# EAGLE schematic M.2 SoM breakout board v0.2-Placement-0305 (EAGLE 9.6.2)
Assembly variants: EVT, proto-click

## Sheet 1 of 3
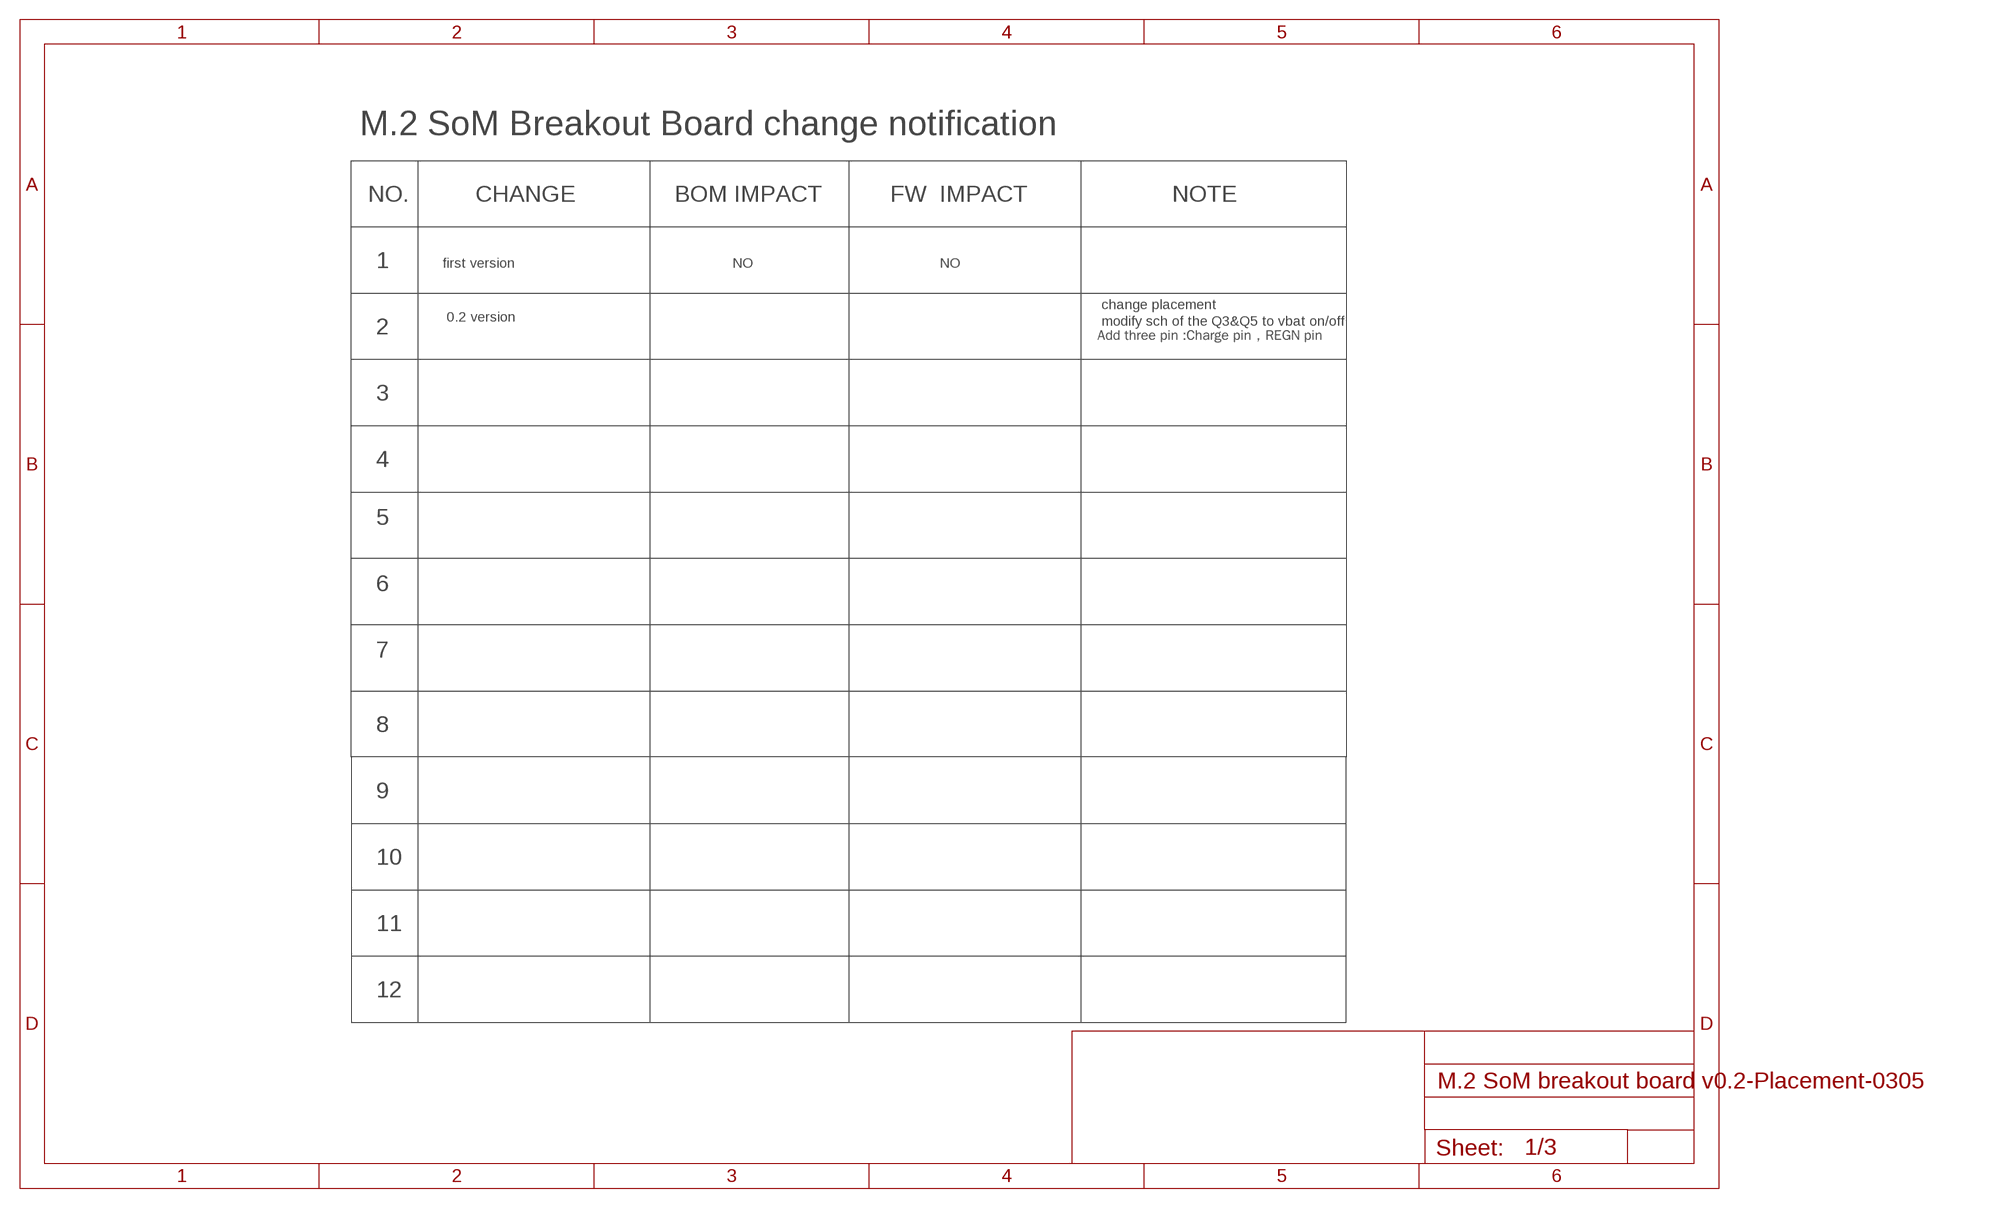
[diagram p0: schematic, sheet 1]

### Notes on the sheet
- M.2 SoM Breakout Board change notification
- NO. | CHANGE | BOM IMPACT | FW  IMPACT | NOTE
- 1 | first version | NO | NO
- change placement
- 0.2 version
- modify sch of the Q3&Q5 to vbat on/off
- 2
- Add three pin :Charge pin，REGN pin
- 3
- 4
- 5
- 6
- 7
- 8
- 9
- 10
- 11
- 12

## Sheet 2 of 3: BSOM
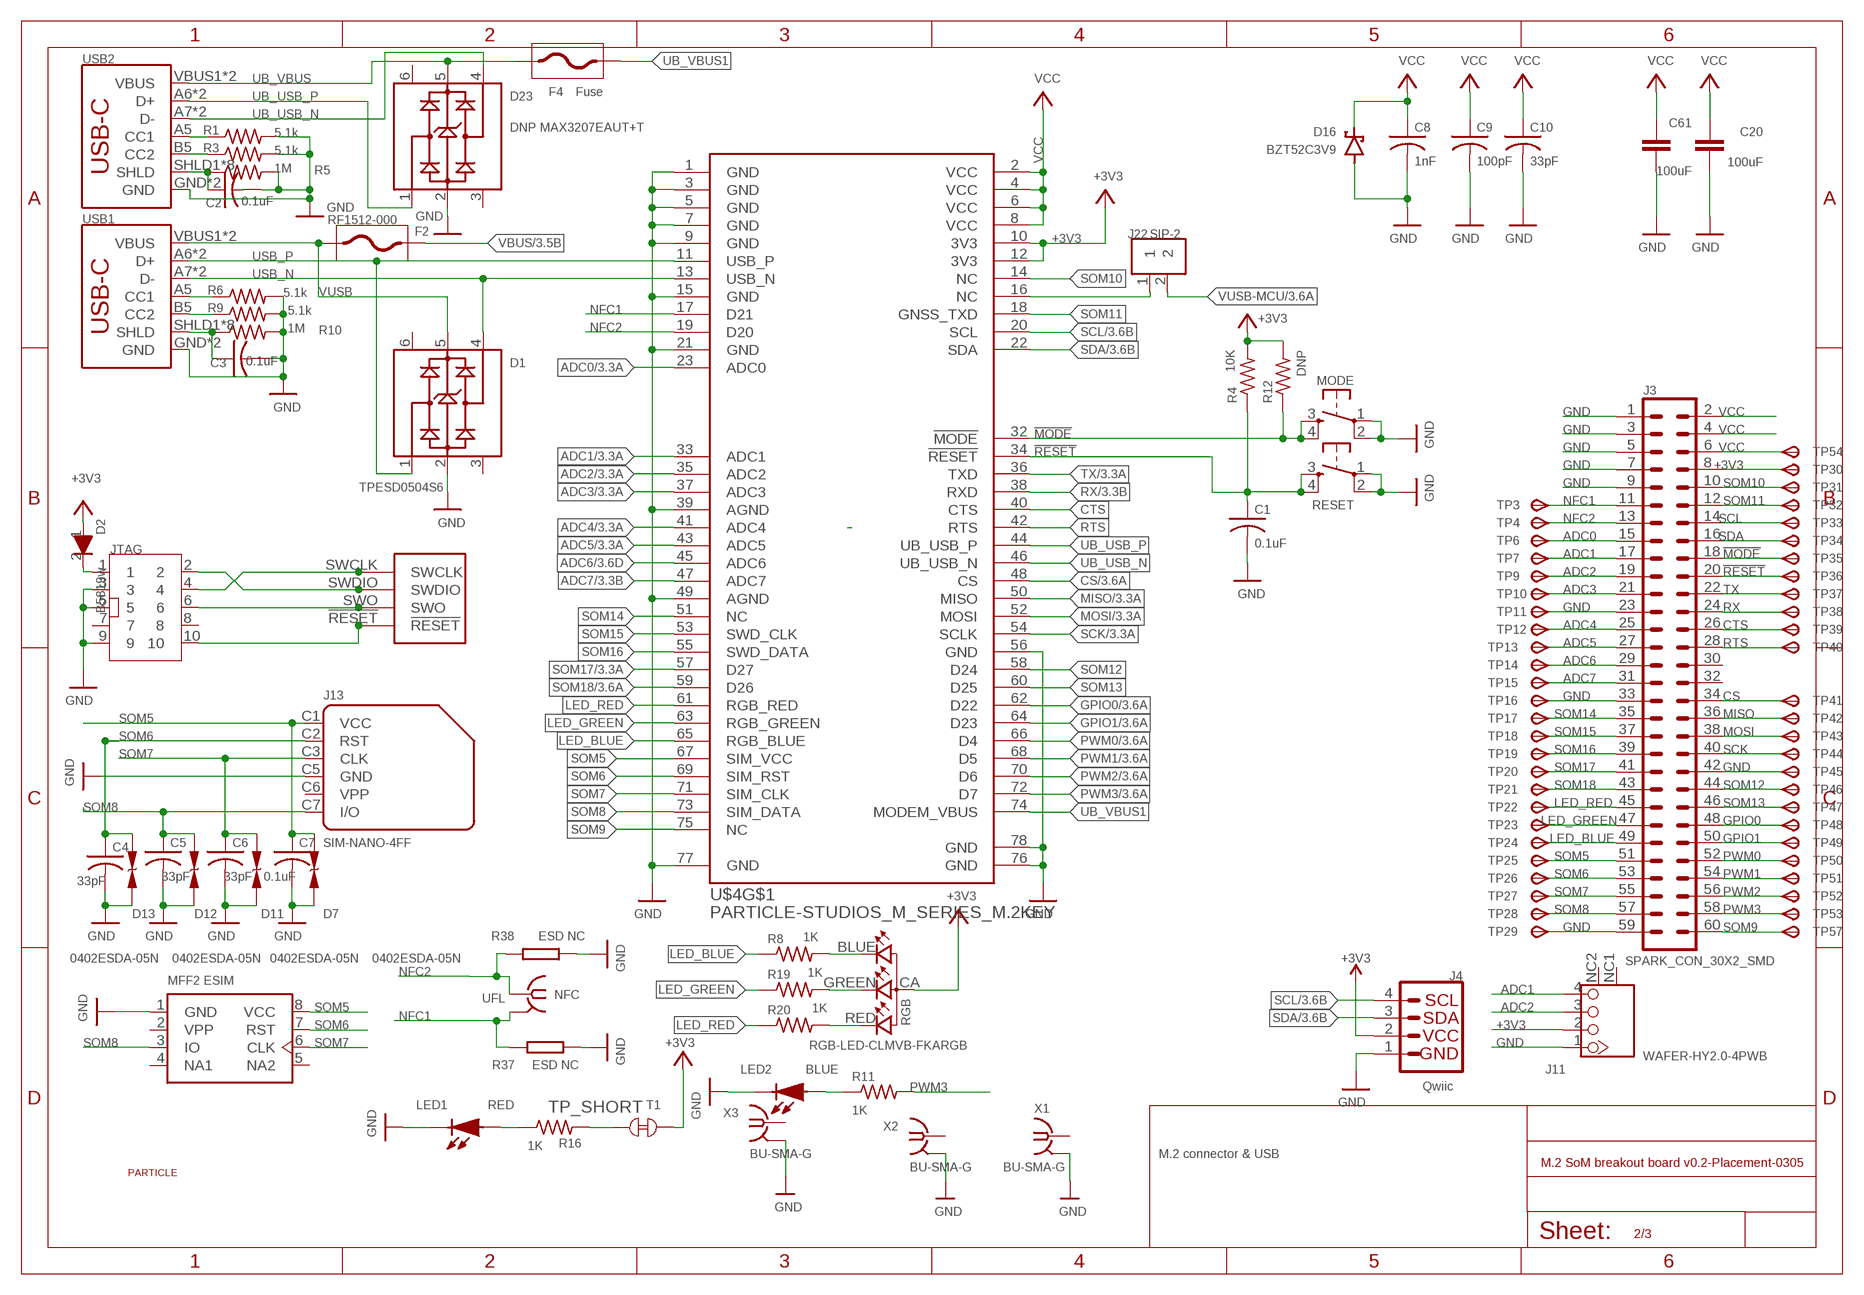
[diagram p1: schematic, sheet 2]

### Parts
C1  0.1uF  C-US  [C0402_B]
C2  0.1uF  C-US  [C0402_B]
C3  0.1uF  C-US  [C0402_B]
C4  33pF  C-US  [C0402_B]
C5  33pF  C-US  [C0402_B]
C6  33pF  C-US  [C0402_B]
C7  0.1uF  C-US  [C0402_B]
C8  1nF  C-US  [C0402_B]
C9  100pF  C-US  [C0402_B]
C10  33pF  C-US  [C0402_B]
C20  100uF  C-EUC1206K  [C1206K]
C61  100uF  C-EUC1206K  [C1206K]
D1  TPESD0504S6  MAX3207EAUT+T  [SOT23-6]
D2  B5819w  DIODESOD123  [SOD-123]
D7  0402ESDA-05N  ESD  [C0402]
D11  0402ESDA-05N  ESD  [C0402]
D12  0402ESDA-05N  ESD  [C0402]
D13  0402ESDA-05N  ESD  [C0402]
D16  BZT52C3V9  MBR0520LT1G  [SOD-123]
D23  DNP MAX3207EAUT+T  MAX3207EAUT+T  [SOT23-6]  (not fitted in variant EVT)
F2  RF1512-000  FUSEF1206  [R1206]
F4  Fuse  FUSE  [F0805]
J3  SPARK_CON_30X2_SMD  [SPARK_CON_30X2_SMD]
J4  QWIIC_CONNECTORJS-1MM  [1X04_1MM_RA]
J11  WAFER-HY2.0-4PWB  [WAFER-HY2.0-4PWB]
J13  SIM-NANO-4FF  [GCT-SIM8100]
J22  SIP-2  [SIP-2]
JTAG  CONN5X2  [CONN5X2_1.27]  (not fitted in variant EVT)
LED1  RED  LED  [LED0603]
LED2  BLUE  LED  [LED0603]
MODE  TAC_SWITCHSMD  [TACTILE_SWITCH_SMD]
NFC  UFL  IPEX-20279-001E  [IPEX-20279-001E]
R1  5.1k  R-US_  [R0402_B]
R3  5.1k  R-US_  [R0402_B]
R4  10K  R-US_  [R0402_B]
R5  1M  R-US_  [R0402_B]
R6  5.1k  R-US_  [R0402_B]
R8  1K  R-US_  [R0402_B]
R9  5.1k  R-US_  [R0402_B]
R10  1M  R-US_  [R0402_B]
R11  1K  R-US_  [R0402_B]
R12  DNP  R-US_  [R0402_B]
R16  1K  R-US_  [R0402_B]
R19  1K  R-US_  [R0402_B]
R20  1K  R-US_  [R0402_B]
R37  ESD NC  RES0402S  [R-0402S]
R38  ESD NC  RES0402S  [R-0402S]
RESET  TAC_SWITCHSMD  [TACTILE_SWITCH_SMD]
RGB  RGB-LED-CLMVB-FKARGB  [PLCC4-2MM-RGB]
T1  TP_SHORT  [TP_SHORT]
TP3  TPSB1,27  [B1,27]
TP4  TPSB1,27  [B1,27]
TP6  TPSB1,27  [B1,27]
TP7  TPSB1,27  [B1,27]
TP9  TPSB1,27  [B1,27]
TP10  TPSB1,27  [B1,27]
TP11  TPSB1,27  [B1,27]
TP12  TPSB1,27  [B1,27]
TP13  TPSB1,27  [B1,27]
TP14  TPSB1,27  [B1,27]
TP15  TPSB1,27  [B1,27]
TP16  TPSB1,27  [B1,27]
TP17  TPSB1,27  [B1,27]
TP18  TPSB1,27  [B1,27]
TP19  TPSB1,27  [B1,27]
TP20  TPSB1,27  [B1,27]
TP21  TPSB1,27  [B1,27]
TP22  TPSB1,27  [B1,27]
TP23  TPSB1,27  [B1,27]
TP24  TPSB1,27  [B1,27]
TP25  TPSB1,27  [B1,27]
TP26  TPSB1,27  [B1,27]
TP27  TPSB1,27  [B1,27]
TP28  TPSB1,27  [B1,27]
TP29  TPSB1,27  [B1,27]
TP30  TPSB1,27  [B1,27]
TP31  TPSB1,27  [B1,27]
TP32  TPSB1,27  [B1,27]
TP33  TPSB1,27  [B1,27]
TP34  TPSB1,27  [B1,27]
TP35  TPSB1,27  [B1,27]
TP36  TPSB1,27  [B1,27]
TP37  TPSB1,27  [B1,27]
TP38  TPSB1,27  [B1,27]
TP39  TPSB1,27  [B1,27]
TP40  TPSB1,27  [B1,27]
TP41  TPSB1,27  [B1,27]
TP42  TPSB1,27  [B1,27]
TP43  TPSB1,27  [B1,27]
TP44  TPSB1,27  [B1,27]
TP45  TPSB1,27  [B1,27]
TP46  TPSB1,27  [B1,27]
TP47  TPSB1,27  [B1,27]
TP48  TPSB1,27  [B1,27]
TP49  TPSB1,27  [B1,27]
TP50  TPSB1,27  [B1,27]
TP51  TPSB1,27  [B1,27]
TP52  TPSB1,27  [B1,27]
TP53  TPSB1,27  [B1,27]
TP54  TPSB1,27  [B1,27]
TP57  TPSB1,27  [B1,27]
U7  NC  ESIMSON8  [MFF2]
U$4  PARTICLE-STUDIOS_M_SERIES_M.2KEY  [PARTICLE-STUDIOS_PARTICLE_M.2EKEY_3.65MM_DRILL]
U$6  PARTICLE-LOGO  [PARTICLE-LOGO]
USB1  USB_C16PIN  [USB-C-16P]
USB2  USB_C16PIN  [USB-C-16P]
X1  BU-SMA-G  [BU-SMA-G]
X2  BU-SMA-G  [BU-SMA-G]
X3  BU-SMA-G  [BU-SMA-G]

### Nets
!MODE: J3.18 MODE.3 MODE.4 R12.1 TP35.TP(PP) U$4.32(!MODE)
!RESET: C1.1 J3.20 JTAG.10 R4.1 RESET.3 RESET.4 TP36.TP(PP) U$4.34(!RESET) U$4.!RESET ; also sheet 3
+3V3: D2.1 J3.8 J4.2 J11.2 R4.2 R12.2 RGB.CA T1.1 TP30.TP(PP) U$4.10(3V3) U$4.12(3V3) ; also sheet 3
ADC0: J3.15 TP6.TP(PP) U$4.23(ADC0) ; also sheet 3
ADC1: J3.17 J11.4 TP7.TP(PP) U$4.33(ADC1) ; also sheet 3
ADC2: J3.19 J11.3 TP9.TP(PP) U$4.35(ADC2) ; also sheet 3
ADC3: J3.21 TP10.TP(PP) U$4.37(ADC3) ; also sheet 3
ADC4: J3.25 TP12.TP(PP) U$4.41(ADC4) ; also sheet 3
ADC5: J3.27 TP13.TP(PP) U$4.43(ADC5) ; also sheet 3
ADC6: J3.29 TP14.TP(PP) U$4.45(ADC6) ; also sheet 3
ADC7: J3.31 TP15.TP(PP) U$4.47(ADC7) ; also sheet 3
CS: J3.34 TP41.TP(PP) U$4.48(CS) ; also sheet 3
CTS: J3.26 TP39.TP(PP) U$4.40(CTS)
GND: C1.2 C2.2 C3.2 C4.2 C5.2 C6.2 C7.2 C8.2 C9.2 C10.2 C20.2 C61.2 D1.2 D7.1 D11.1 D12.1 D13.1 D16.A D23.2 J3.1 J3.3 J3.5 J3.7 J3.9 J3.23 J3.33 J3.42 J3.59 J4.1 J11.1 J13.C5(GND) JTAG.3 JTAG.5 JTAG.9 LED1.2(K) LED2.2(K) MODE.1 MODE.2 R1.2 R3.2 R5.2 R6.2 R9.2 R10.2 R37.2 R38.1 RESET.1 RESET.2 TP11.TP(PP) TP16.TP(PP) TP29.TP(PP) TP45.TP(PP) U7.1(GND) U$4.1(GND) U$4.3(GND) U$4.5(GND) U$4.7(GND) U$4.9(GND) U$4.15(GND) U$4.21(GND) U$4.39(AGND) U$4.49(AGND) U$4.56(GND) U$4.76(GND) U$4.77(GND) U$4.78(GND) USB1.GND USB1.GND2(GND) USB2.GND USB2.GND2(GND) X1.2 X1.3 X1.4 X1.5 X2.2 X2.3 X2.4 X2.5 X3.2 X3.3 X3.4 X3.5 ; also sheet 3
GPIO0: J3.48 TP48.TP(PP) U$4.62(D22) ; also sheet 3
GPIO1: J3.50 TP49.TP(PP) U$4.64(D23) ; also sheet 3
LED_BLUE: J3.49 R8.1 TP24.TP(PP) U$4.65(RGB_BLUE)
LED_BLUE1: R8.2 RGB.BLUE
LED_GREEN: J3.47 R19.1 TP23.TP(PP) U$4.63(RGB_GREEN)
LED_GREEN1: R19.2 RGB.GREEN
LED_RED: J3.45 R20.1 TP22.TP(PP) U$4.61(RGB_RED)
LED_RED1: R20.2 RGB.RED
MISO: J3.36 TP42.TP(PP) U$4.50(MISO) ; also sheet 3
MOSI: J3.38 TP43.TP(PP) U$4.52(MOSI) ; also sheet 3
N$1: R1.1 USB2.A5(CC1)
N$2: R3.1 USB2.B5(CC2)
N$3: C2.1 R5.1 USB2.SHLD1(SHLD) USB2.SHLD2(SHLD) USB2.SHLD3(SHLD) USB2.SHLD4(SHLD) USB2.SHLD5(SHLD) USB2.SHLD6(SHLD) USB2.SHLD7(SHLD) USB2.SHLD8(SHLD)
N$4: R6.1 USB1.A5(CC1)
N$5: R9.1 USB1.B5(CC2)
N$6: D2.2 JTAG.1
N$8: C3.1 R10.1 USB1.SHLD1(SHLD) USB1.SHLD2(SHLD) USB1.SHLD3(SHLD) USB1.SHLD4(SHLD) USB1.SHLD5(SHLD) USB1.SHLD6(SHLD) USB1.SHLD7(SHLD) USB1.SHLD8(SHLD)
N$19: LED1.1(A) R16.1
N$36: LED2.1(A) R11.1
N$44: R16.2 T1.2
NFC1: J3.11 NFC.2@1(GND) NFC.2@2(GND) R37.1 TP3.TP(PP) U$4.17(D21)
NFC2: J3.13 NFC.1 R38.2 TP4.TP(PP) U$4.19(D20)
PWM0: J3.52 TP50.TP(PP) U$4.66(D4) ; also sheet 3
PWM1: J3.54 TP51.TP(PP) U$4.68(D5) ; also sheet 3
PWM2: J3.56 TP52.TP(PP) U$4.70(D6) ; also sheet 3
PWM3: J3.58 R11.2 TP53.TP(PP) U$4.72(D7) ; also sheet 3
RTS: J3.28 TP40.TP(PP) U$4.42(RTS)
RX: J3.24 TP38.TP(PP) U$4.38(RXD) ; also sheet 3
SCK: J3.40 TP44.TP(PP) U$4.54(SCLK) ; also sheet 3
SCL: J3.14 J4.4 TP33.TP(PP) U$4.20(SCL) ; also sheet 3
SDA: J3.16 J4.3 TP34.TP(PP) U$4.22(SDA) ; also sheet 3
SOM5: C7.1 D7.2 J3.51 J13.C1(VCC) TP25.TP(PP) U7.8(VCC) U$4.67(SIM_VCC)
SOM6: C4.1 D13.2 J3.53 J13.C2(RST) TP26.TP(PP) U7.7(RST) U$4.69(SIM_RST)
SOM7: C6.1 D11.2 J3.55 J13.C3(CLK) TP27.TP(PP) U7.6(CLK) U$4.71(SIM_CLK)
SOM8: C5.1 D12.2 J3.57 J13.C7(I/O) TP28.TP(PP) U7.3(IO) U$4.73(SIM_DATA)
SOM9: J3.60 TP57.TP(PP) U$4.75(NC)
SOM10: J3.10 TP31.TP(PP) U$4.14(NC)
SOM11: J3.12 TP32.TP(PP) U$4.18(GNSS_TXD)
SOM12: J3.44 TP46.TP(PP) U$4.58(D24)
SOM13: J3.46 TP47.TP(PP) U$4.60(D25)
SOM14: J3.35 TP17.TP(PP) U$4.51(NC)
SOM15: J3.37 TP18.TP(PP) U$4.53(SWD_CLK)
SOM16: J3.39 TP19.TP(PP) U$4.55(SWD_DATA)
SOM17: J3.41 TP20.TP(PP) U$4.57(D27) ; also sheet 3
SOM18: J3.43 TP21.TP(PP) U$4.59(D26) ; also sheet 3
SWCLK: JTAG.4 U$4.SWCLK
SWDIO: JTAG.2 U$4.SWDIO
SWO: JTAG.6 U$4.SWO
TX: J3.22 TP37.TP(PP) U$4.36(TXD) ; also sheet 3
UB_USB_N: D23.4 U$4.46(UB_USB_N) USB2.A7(D-) USB2.B7(D-)
UB_USB_P: D23.1 U$4.44(UB_USB_P) USB2.A6(D+) USB2.B6(D+)
UB_VBUS: D23.5 F4.P$2 USB2.VBUS1(VBUS) USB2.VBUS2(VBUS)
UB_VBUS1: F4.P$1 U$4.74(MODEM_VBUS)
USB_N [120R_Impedance]: D1.4 U$4.13(USB_N) USB1.A7(D-) USB1.B7(D-)
USB_P [120R_Impedance]: D1.1 U$4.11(USB_P) USB1.A6(D+) USB1.B6(D+)
VBUS: F2.2 ; also sheet 3
VCC: C8.1 C9.1 C10.1 C20.1 C61.1 D16.C J3.2 J3.4 J3.6 TP54.TP(PP) U$4.2(VCC) U$4.4(VCC) U$4.6(VCC) U$4.8(VCC) ; also sheet 3
VUSB: D1.5 F2.1 USB1.VBUS1(VBUS) USB1.VBUS2(VBUS)
VUSB-MCU: J22.2 ; also sheet 3
VUSBMCU: J22.1 U$4.16(NC)
Unconnected: D1.3 D1.6 D23.3 D23.6 J3.30 J3.32 J11.NC1 J11.NC2 J13.C6(VPP) JTAG.7 JTAG.8 U7.4(NA1) U7.5(NA2) X1.1 X2.1 X3.1

### Notes on the sheet
- MFF2 ESIM
- Qwiic
- M.2 connector & USB

## Sheet 3 of 3: WATCHDOG AND FRAM
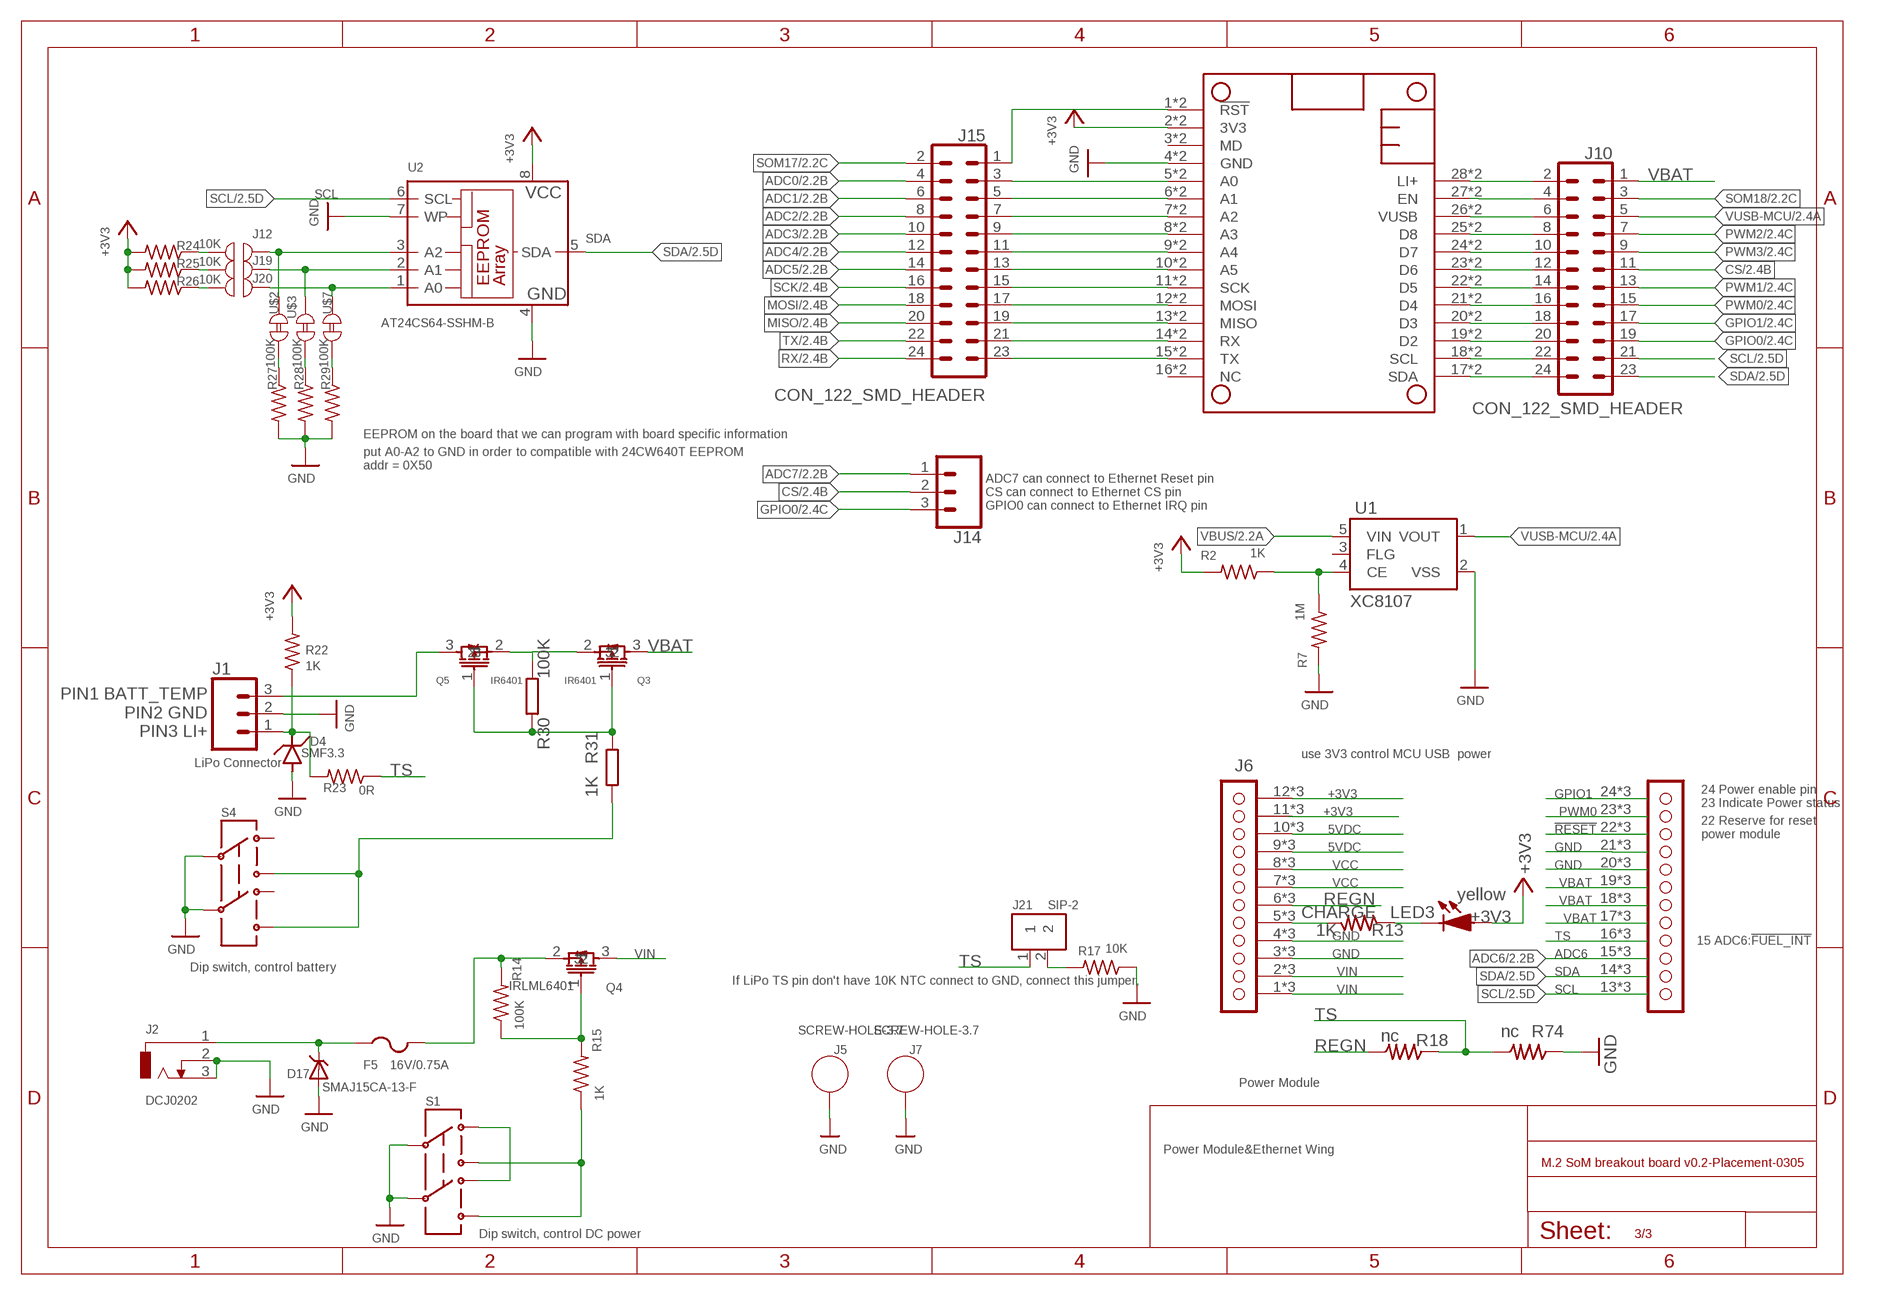
[diagram p2: schematic, sheet 3]

### Parts
D4  SMF3.3  TVS-DIODE-SOD123FL  [SOD-123FL]
D17  SMAJ15CA-13-F  DIODE-ZENER  [SMADIODE]
F5  16V/0.75A  PTCFUSE-1206  [R1206]
J1  CONN_03JST-SMD-VERT  [JST-3-SMD-VERT]
J2  DCJ0202  [DCJ0202]
J5  SCREW-HOLE-3.7  [SCREW-HOLE-3.7]
J6  PARTICLE-SZ_PARTICLE-POWER-MODULE  [PARTICLE-SZ_PARTICLE-POWER-MODULE]
J7  SCREW-HOLE-3.7  [SCREW-HOLE-3.7]
J10  CON_122_SMD_HEADER  [CON_12*2_SMD_HEADER]
J12  TP_OPEN  [TP_OPEN]
J14  CONN_03  [1X03]
J15  CON_122_SMD_HEADER  [CON_12*2_SMD_HEADER]
J19  TP_OPEN  [TP_OPEN]
J20  TP_OPEN  [TP_OPEN]
J21  SIP-2  [SIP-2]
LED3  yellow  LED  [LED0603]
MS1  PARTICLE_MESH_SMTDUAL  [FEATHERWING_SMT2]
Q3  IR6401  PMOS  [SOT-23]
Q4  IRLML6401  PMOS  [SOT-23]
Q5  IR6401  PMOS  [SOT-23]
R2  1K  R-US_  [R0402_B]
R7  1M  R-US_  [R0402_B]
R13  1K  RES0402S  [R-0402S]
R14  100K  R-US_  [R0402_B]
R15  1K  R-US_  [R0402_B]
R17  10K  R-US_  [R0402_B]
R18  nc  RES0402S  [R-0402S]
R22  1K  R-US_  [R0402_B]
R23  0R  R-US_  [R0402_B]
R24  10K  R-US_  [R0402_B]
R25  10K  R-US_  [R0402_B]
R26  10K  R-US_  [R0402_B]
R27  100K  R-US_  [R0402_B]
R28  100K  R-US_  [R0402_B]
R29  100K  R-US_  [R0402_B]
R30  100K  RESR0603  [R0603]
R31  1K  RES0402S  [R-0402S]
R74  nc  RES0402S  [R-0402S]
S1  SWITCH-DPDT  [SWITCH-2.5X3.2-6]
S4  SWITCH-DPDT  [SWITCH-2.5X3.2-6]
U1  XC8107  XC8107SOT25  [SOT25]
U2  AT24CS64-SSHM-B  24AA01SN  [SO-08]  (not fitted in variant proto-click)
U$2  TP_SHORT  [TP_SHORT]
U$3  TP_SHORT  [TP_SHORT]
U$7  TP_SHORT  [TP_SHORT]

### Nets
5VDC: J6.9(5DC) J6.10(5DC) J6.@9(5DC) J6.@10(5DC) J6.P$9(5DC) J6.P$10(5DC)
!RESET: J6.22(!RST) J6.@22(!RST) J6.P$22(!RST) ; also sheet 2
+3V3: J6.11(3V3) J6.12(3V3) J6.@11(3V3) J6.@12(3V3) J6.P$11(3V3) J6.P$12(3V3) LED3.1(A) MS1.2'(3V3) MS1.2(3V3) R2.2 R22.2 R24.2 R25.2 R26.2 U2.8(VCC) ; also sheet 2
ADC0: J15.4 ; also sheet 2
ADC1: J15.6 ; also sheet 2
ADC2: J15.8 ; also sheet 2
ADC3: J15.10 ; also sheet 2
ADC4: J15.12 ; also sheet 2
ADC5: J15.14 ; also sheet 2
ADC6: J6.15(!FUEL-INT) J6.@15(!FUEL-INT) J6.P$15(!FUEL-INT) ; also sheet 2
ADC7: J14.1 ; also sheet 2
CHARGE: J6.5(NC) J6.@5(NC) J6.P$5(NC) R13.2
CS: J10.11 J14.2 ; also sheet 2
GND: D4.A D17.A J1.2 J2.2 J2.3 J5.P$1(GND) J6.3(GND) J6.4(GND) J6.20(GND) J6.21(GND) J6.@3(GND) J6.@4(GND) J6.@20(GND) J6.@21(GND) J6.P$3(GND) J6.P$4(GND) J6.P$20(GND) J6.P$21(GND) J7.P$1(GND) MS1.4'(GND) MS1.4(GND) R7.2 R17.1 R27.2 R28.2 R29.2 R74.1 S1.2 S1.5 S4.2 S4.5 U1.2(VSS) U2.4(GND) U2.7(WP) ; also sheet 2
GPIO0: J10.19 J14.3 ; also sheet 2
GPIO1: J6.24(ENABLE) J6.@24(ENABLE) J6.P$24(ENABLE) J10.17 ; also sheet 2
LI+: J10.2 MS1.28'(LI+) MS1.28(LI+)
MISO: J15.20 ; also sheet 2
MOSI: J15.18 ; also sheet 2
N$7: D4.C J1.1 R22.1 R23.2
N$9: R2.1 R7.1 U1.4(CE)
N$11: F5.2 Q4.2 R14.2
N$13: LED3.2(K) R13.1
N$16: J10.10 MS1.24'(D7) MS1.24(D7)
N$17: Q4.1 R14.1 R15.2
N$18: R15.1 S1.3 S1.6
N$21: J15.3 MS1.5'(A0) MS1.5(A0)
N$23: J15.5 MS1.6'(A1) MS1.6(A1)
N$24: J15.7 MS1.7'(A2) MS1.7(A2)
N$25: J15.9 MS1.8'(A3) MS1.8(A3)
N$26: J15.11 MS1.9'(A4) MS1.9(A4)
N$27: J15.13 MS1.10'(A5) MS1.10(A5)
N$28: J15.15 MS1.11'(SCK) MS1.11(SCK)
N$29: J15.17 MS1.12'(MOSI) MS1.12(MOSI)
N$30: J15.19 MS1.13'(MISO) MS1.13(MISO)
N$31: J15.21 MS1.14'(RX) MS1.14(RX)
N$32: J15.23 MS1.15'(TX) MS1.15(TX)
N$33: S1.1 S1.4
N$34: J10.24 MS1.17'(SDA) MS1.17(SDA)
N$35: J10.22 MS1.18'(SCL) MS1.18(SCL)
N$37: J10.20 MS1.19'(D2) MS1.19(D2)
N$38: J10.18 MS1.20'(D3) MS1.20(D3)
N$39: J10.16 MS1.21'(D4) MS1.21(D4)
N$40: J10.14 MS1.22'(D5) MS1.22(D5)
N$41: J10.12 MS1.23'(D6) MS1.23(D6)
N$42: J10.8 MS1.25'(D8) MS1.25(D8)
N$43: J10.4 MS1.27'(EN) MS1.27(EN)
N$45: D17.C F5.1 J2.1
N$46: J15.1 MS1.1'(!RST) MS1.1(!RST)
N$47: R27.1 U$2.1
N$48: R28.1 U$3.1
N$49: J12.2 U2.3(A2) U$2.2
N$50: J19.2 U2.2(A1) U$3.2
N$51: J12.1 R24.1
N$52: J19.1 R25.1
N$53: J20.1 R26.1
N$54: J20.2 U2.1(A0) U$7.2
N$55: R29.1 U$7.1
N$57: J21.2 R17.2
N$58: J1.3 Q5.3
N$300: Q3.2 Q5.2 R30.2
N$301: Q3.1 Q5.1 R30.1 R31.1
N$302: R31.2 S4.3 S4.6
PWM0: J6.23(PG) J6.@23(PG) J6.P$23(PG) J10.15 ; also sheet 2
PWM1: J10.13 ; also sheet 2
PWM2: J10.7 ; also sheet 2
PWM3: J10.9 ; also sheet 2
REGN: J6.6(NC) J6.@6(NC) J6.P$6(NC) R18.2
RX: J15.24 ; also sheet 2
SCK: J15.16 ; also sheet 2
SCL: J6.13(SCL) J6.@13(SCL) J6.P$13(SCL) J10.21 U2.6(SCL) ; also sheet 2
SDA: J6.14(SDA) J6.@14(SDA) J6.P$14(SDA) J10.23 U2.5(SDA) ; also sheet 2
SOM17: J15.2 ; also sheet 2
SOM18: J10.3 ; also sheet 2
TS: J6.16(TS) J6.@16(TS) J6.P$16(TS) J21.1 R18.1 R23.1 R74.2
TX: J15.22 ; also sheet 2
V-USB: J10.6 MS1.26'(VUSB) MS1.26(VUSB)
VBAT: J6.17(VBAT) J6.18(VBAT) J6.19(VBAT) J6.@17(VBAT) J6.@18(VBAT) J6.@19(VBAT) J6.P$17(VBAT) J6.P$18(VBAT) J6.P$19(VBAT) J10.1 Q3.3
VBUS: U1.5(VIN) ; also sheet 2
VCC: J6.7(VCC) J6.8(VCC) J6.@7(VCC) J6.@8(VCC) J6.P$7(VCC) J6.P$8(VCC) ; also sheet 2
VIN: J6.1(VIN) J6.2(VIN) J6.@1(VIN) J6.@2(VIN) J6.P$1(VIN) J6.P$2(VIN) Q4.3
VUSB-MCU: J10.5 U1.1(VOUT) ; also sheet 2
Unconnected: MS1.3'(MD) MS1.3(MD) MS1.16'(NC) MS1.16(NC) S4.1 S4.4 U1.3(FLG)

### Notes on the sheet
- EEPROM on the board that we can program with board specific information
- put A0-A2 to GND in order to compatible with 24CW640T EEPROM
  addr = 0X50
- ADC7 can connect to Ethernet Reset pin
  CS can connect to Ethernet CS pin
  GPIO0 can connect to Ethernet IRQ pin
- PIN1 BATT_TEMP
  PIN2 GND
  PIN3 LI+
- use 3V3 control MCU USB  power
- LiPo Connector
- 24 Power enable pin
- 23 Indicate Power status
- 22 Reserve for reset 
  power module
- 15 ADC6:!FUEL_INT
- Dip switch, control battery
- If LiPo TS pin don't have 10K NTC connect to GND, connect this jumper,
- Power Module
- Power Module&Ethernet Wing
- Dip switch, control DC power

## Power pins joined to a net without a drawn wire
VPP: U7.2(VPP)

## Library data of the parts
C1-C10 = Particle:C-US: Capacitor
C20 C61 = rcl:C-EU: CAPACITOR, European symbol; SPICEPREFIX: C
D1 D23 = particle-studios:MAX3207; DESP: TVS DIODE SOT23-6; MFG: MAXIM; MPN: MAX3207EAUT+T; PPN: PC-201321
D2 = particle SZ:DIODE: DIODE
D4 = particle-studios:TVS-DIODE-SOD123
D7 D11-D13 = particle SZ:ESD
D16 = Diodes:MBR0520LT1G: DIODE SCHOTTKY 20V 500MA SOD123 Manufacturer's datasheet <https://www.onsemi.com/pub/Collateral/MBR0520LT1-D.PDF>; CREATED_BY: PCBLayout.com; DIGIKEY_PART_NUMBER: MBR0520LT1GOSTR-ND; MANUFACTURER: ON Semiconductor; MPN: MBR0520LT1G; PACKAGE: SOD-123
D17 = particle-studios:DIODE-ZENER
F2 F4 = RedBear:FUSE
F5 = adafruit:PTCFUSE: PTC fuses, resettable thermistors
J1 J14 = particle-studios:CONN_03: Multi connection point. Often used as Generic Header-pin footprint for 0.1 inch spaced/style header connections On any of the 0.1 inch spaced packages, you can populate with these: Break Away Headers - Straight <https://www.sparkfun.com/products/116> (PRT-00116) Break Away Male Headers - Right Angle <https://www.sparkfun.com/products/553> (PRT-00553) Female Headers <https://www.sparkfun.com/products/115> (PRT-00115) Break Away Headers - Machine Pin <https://www.sparkfun.com/products/117> (PRT-00117) Break Away Female Headers - Swiss Machine Pin <https://www.sparkfun.com/products/743> (PRT-00743) Stackable Header - 3 Pin (Female, 0.1") <https://www.sparkfun.com/products/13875> (PRT-13875) For SCREWTERMINALS and SPRING TERMINALS visit here: Screw Terimnals on SparkFun.com <https://www.sparkfun.com/search/results?term=Screw+Terminals> (5mm/3.5mm/2.54mm spacing) This device is also useful as a general connection point to wire up your design to another part of your project. Our various solder wires solder well into these plated through hole pads. Hook-Up Wire - Assortment (Stranded, 22 AWG) <https://www.sparkfun.com/products/11375> (PRT-11375) Hook-Up Wire - Assortment (Solid Core, 22 AWG) <https://www.sparkfun.com/products/11367> (PRT-11367) View the entire wire category on our website here <https://www.sparkfun.com/categories/141> Special notes: Molex polarized connector foot print use with SKU : PRT-08232 with associated crimp pins and housings.
J2 = con-jack:DCJ0202: DC POWER JACK Source: DCJ0202.pdf; OC_FARNELL: unknown; OC_NEWARK: unknown
J3 = MESH SOM EVAL BOARD:SPARK_CON_30X2_SMD: CON30*2SMD
J4 = SparkFun-Connectors:QWIIC_CONNECTOR: SparkFun I2C Standard Qwiic Connector An SMD 1mm pitch JST connector makes it easy and quick (get it? Qwiic?) to connect I2C devices to each other. The Qwiic system <http://www.sparkfun.com/qwiic> enables fast and solderless connection between popular platforms and various sensors and actuators. We carry 200mm <https://www.sparkfun.com/products/14204>, 100mm <https://www.sparkfun.com/products/14205>, 50mm <https://www.sparkfun.com/products/14206>, and breadboard friendly <https://www.sparkfun.com/products/14207> Qwiic cables. We also offer 10 pcs strips <https://www.sparkfun.com/products/14323> the SMD connectors.; PROD_ID: CONN-13694
J5 J7 = SOM EVAL BOARD V1.10:SCREW-HOLE-3.7: Screw,Drill diameter 2.6mm
J6 = M.2 SoM breakout board v0.2-0228:PARTICLE-SZ_PARTICLE-POWER-MODULE
J10 J15 = Spark:CON_12*2_SMD_HEADER
J11 = M.2 SoM breakout board v0.2-0228:WAFER-HY2.0-4PWB
J12 J19 J20 = particle SZ:TP_OPEN
J13 = Bretts-Spark-Library:SIM-NANO-4FF: SIM NANO 4FF
J21 J22 = particle SZ:SIP-2
JTAG = particle-studios:CONN5X2: 5x2 pin JTAG connector for Particle mesh dev kits; DESP: Connector 2x5pin 1.27mm pitch SMD ROHS; MFG: KAWEEI; MPN: P6014A-M2GC-030-10; PPN: PT-200714
LED1-LED3 = particle SZ:LED: LED
MODE RESET = Particle:TAC_SWITCH: SMD Tactiile Switch; DESP: SWITCH TACTILE SPST-NO 0.3A 12V 160GF 4-SMD; MFG: HAOYU; MPN: TS-1185A-025C; PPN: PT-200911
MS1 = M.2 SoM breakout board v0.1:PARTICLE_MESH
NFC = Particle:IPEX-20279-001E: Ultra Miniature Coaxial SMT RF Receptacle
Q3-Q5 = RedBear:PMOS: PMOS
R1-R12 R14-R17 R19 R20 R22-R29 = Particle:R-US_: 0402 Resistor
R13 R18 R74 = particle SZ:RES: RES
R30 R31 R37 R38 = RedBear:RES: RES
RGB = Particle:RGB-LED-CLMVB-FKA: CREE CLMVB-FKA RGB LED 2mm x 2mm
S1 S4 = SparkFun-Retired:SWITCH-DPDT: DPDT Version of the COM-00597
T1 U$2 U$3 U$7 = particle SZ:TP_SHORT
TP3 TP4 TP6 TP7 TP9-TP54 TP57 = testpad:TPS: TEST PIN
U1 = Particle:XC8107
U2 = microchip:24*: Serial EEPROM I2C; MF: MICROCHIP; MPN: 24AA01/SN; OC_FARNELL: 1331268; OC_NEWARK: 89C9792
U7 = Particle:ESIM
U$4 = M.2 SoM breakout board v0.2-0228:PARTICLE-STUDIOS_M_SERIES_M.2KEY
U$6 = particle SZ:PARTICLE-LOGO
USB1 USB2 = SparkFun-Connectors:USB_C: USB Type C 16Pin Connector Super Speed pins not available on the 16-pin purely SMD connector so this part is best for USB 2.0 implementations. D1 and D2 are tied together enabling D+/- no matter which way the cable is plugged into the connector. The two channel configuration pins (CC1/2) are exposed. These are normally connected to ground via 5.1k resistors but can be reconfigured for high current/high power applications.; PROD_ID: CONN-14122
X1-X3 = con-coax:BU-SMA-G: FEMALE SMA CONNECTOR Radiall distributor RS 193-9117; OC_FARNELL: unknown; OC_NEWARK: unknown

## Net classes
0 default: width 0.152 mm, clearance 0.152 mm
1 power: width 0.254 mm, drill 0.61 mm, clearance 0.203 mm
2 120R_Impedance: width 0.152 mm
3 BAT: clearance 0.203 mm